# Altium schematic sheet USB_CH340G.SchDoc
size A; DocumentNumber: 5; SheetNumber: 5; SheetTotal: 7
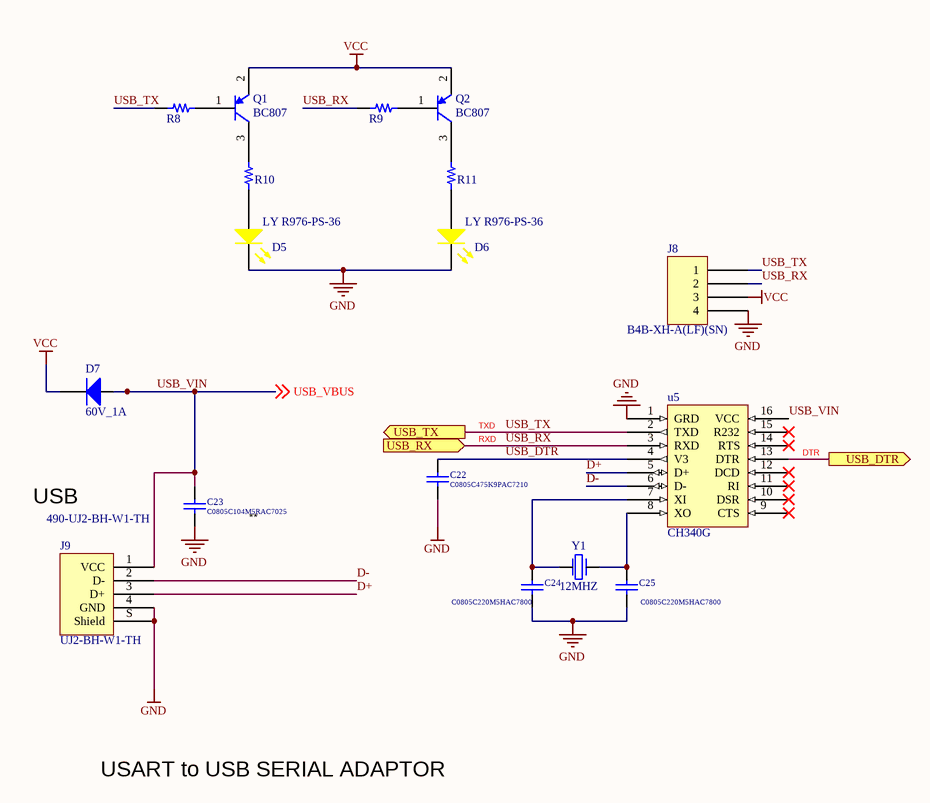
[diagram p0: USB_CH340G.SchDoc]

## Parts
C22  C0805C475K9PAC7210  [CAP SMD 0805]
C23  C0805C104M5RAC7025  [CAP SMD 0805]
C24  C0805C220M5HAC7800  [CAP SMD 0805]
C25  C0805C220M5HAC7800  [CAP SMD 0805]
D5  LY R976-PS-36  [LED 0805]
D6  LY R976-PS-36  [LED 0805]
D7  60V_1A  [SOD-123-]
J8  B4B-XH-A(LF)(SN)  [XH-Conn 1*4 straight]
J9  UJ2-BH-W1-TH  Supplier Part Number 1: 490-UJ2-BH-W1-TH  [FCI USB 61729-1011BLF]
Q1  BC807  [SOT-23]
Q2  BC807  [SOT-23]
R8  1K  [RES SMD 0805]  (value not drawn)
R9  1K  [RES SMD 0805]  (value not drawn)
R10  1K  [RES SMD 0805]  (value not drawn)
R11  1K  [RES SMD 0805]  (value not drawn)
u5  CH340G  [16-SOIC]
Y1  12MHZ  [AP7-00085]

## Ports
USB_DTR (out), USB_RX (in), USB_TX (out)

## Nets
GND: C22.1 C23.1 C24.1 C25.1 D5.1(Cathode) D6.1(Cathode) J8.4 J9.4(GND) J9.S(Shield) u5.1(GRD)
VCC: D7.1(CATHODE) J8.3 Q1.2(E) Q2.2(E)
D+: J9.3(D+) u5.5(D+)
D-: J9.2(D-) u5.6(D-)
DTR: u5.13(DTR) ; port USB_DTR
RXD: J8.2 R9.1 u5.3(RXD) ; port USB_RX  [also labelled USB_RX]
TXD: J8.1 R8.1 u5.2(TXD) ; port USB_TX  [also labelled USB_TX]
USB_DTR: C22.2 u5.4(V3)
USB_VIN: C23.2 D7.2(ANODE) J9.1(VCC) u5.16(VCC) ; off-sheet USB_VBUS  [also labelled USB_VBUS]
NetC24_2: C24.2 u5.7(XI) Y1.1
NetC25_2: C25.2 u5.8(XO) Y1.2
NetD5_2: D5.2(Anode) R10.1
NetD6_2: D6.2(Anode) R11.1
NetQ1_1: Q1.1(B) R8.2
NetQ1_3: Q1.3(C) R10.2
NetQ2_1: Q2.1(B) R9.2
NetQ2_3: Q2.3(C) R11.2

Not connected (* = marked no-connect by the designer): u5 9(CTS)* 10(DSR)* 11(RI)* 12(DCD)* 14(RTS)* 15(R232)*

## Notes on the sheet
- USB
- **
- USART to USB SERIAL ADAPTOR

## Library data of the parts
C22 = Cap_3: 4.7 µF ±10% 6.3V Ceramic Capacitor X5R 0805 (2012 Metric); Value: 0.1uF; Published: 8-Jun-2000; LatestRevisionDate: 17-Jul-2002; LatestRevisionNote: Re-released for DXP Platform.; PackageReference: RAD-0.3; Publisher: Altium Limited; PackageDescription: Radial Cap, Thru-Hole; 2 Leads; 0.3 in Pin Spacing
C23 = Cap_3: 0.1 µF ±20% 50V Ceramic Capacitor X7R 0805 (2012 Metric); Value: 0.1uF; Published: 8-Jun-2000; LatestRevisionDate: 17-Jul-2002; LatestRevisionNote: Re-released for DXP Platform.; PackageReference: RAD-0.3; Publisher: Altium Limited; PackageDescription: Radial Cap, Thru-Hole; 2 Leads; 0.3 in Pin Spacing
C24 C25 = Cap_3: 22 pF ±20% 50V Ceramic Capacitor X8R 0805 (2012 Metric); Value: 0.1uF; Published: 8-Jun-2000; LatestRevisionDate: 17-Jul-2002; LatestRevisionNote: Re-released for DXP Platform.; PackageReference: RAD-0.3; Publisher: Altium Limited; PackageDescription: Radial Cap, Thru-Hole; 2 Leads; 0.3 in Pin Spacing
D5 D6 = SMD LED INDICATORS: LED YELLOW DIFFUSED 0805 SMD
D7 = Diod_1: DIODE SCHOTTKY 60V 1A SOD123; Published: 8-Jun-2000; LatestRevisionDate: 17-Jul-2002; LatestRevisionNote: Re-released for DXP Platform.; PackageVersion: Sep-1996; PackageReference: SMC; Publisher: Altium Limited; PackageDescription: DO-214-AB/SMC; 2 C-Bend Leads; Body 7.9 x 5.9 mm, inc. leads (LxW); Code_JEDEC: DO-214-AB
J8 = B4B-XH-A(LF)(SN): CONN HEADER VERT 4POS 2.5MM; Manufacturer: JST Sales America Inc.; Contact Length - Post: 0.134" (3.40mm); Current Rating (Amps): 3A; Material Flammability Rating: UL94 V-0; Number of Positions: 4; Number of Positions Loaded: All; Pitch - Mating: 0.098" (2.50mm); Shrouding: Shrouded - 4 Wall; Style: Board to Cable/Wire; Voltage Rating: 250V; Part Number: B4B-XH-A(LF)(SN); ComponentLink1Description: Datasheet; ComponentLink1URL: http://www.jst-mfg.com/product/pdf/eng/eXH.pdf; ComponentLink2Description: DigiKey Link; ComponentLink2URL: http://digikey.com/product-detail/en/jst-sales-america-inc/B4B-XH-A-LF-SN/455-2249-ND/1651047; Connector Type: Header; Contact Finish - Mating: Tin; Contact Finish - Post: Tin; Contact Material: Brass; Contact Shape: Square; Contact Type: Male Pin; Fastening Type: Detent Lock; Insulation Color: Natural; Insulation Height: 0.276" (7.00mm); Insulation Material: Polyamide (PA66), Nylon 6/6; LastUpdated: 1/12/2020 11:46:34 PM; Lifecycle Status: Active; Minimum Order: 1; Mounting Type: Through Hole; Number of Rows: 1; Operating Temperature: -25°C ~ 85°C; Packaging: Bulk; PartId: 69; Part Status: Active; Price: 0.21; Series: XH; Supplier 1: DigiKey; Supplier Part Number 1: 455-2249-ND; Termination: Press-Fit, Solder
J9 = USB 2.0 Type B: USB-B (USB TYPE-B) USB 2.0 Receptacle Connector 4 Position Through Hole, Right Angle; Supplier 1: Mouser
Q1 Q2 = PNP Transistor: TRANS PNP 45V 0.5A SOT-23; Published: 8-Jun-2000; LatestRevisionDate: 29-May-2009; LatestRevisionNote: IPC-7351 Footprint Added.; PackageVersion: Aug-1999; PackageReference: SOT-23B; Publisher: Altium Limited; PackageDescription: 3-Pin SOT-23 Package 0.95 mm Pitch, 2.4 mm Lead Span
R8-R11 = RESISTOR: RES SMD 1K OHM 1% 1/4W 0805
u5 = CH340G: CH340G USB TO SERIAL (TTL) IC
Y1 = CRYSTAL: 12 MHz ±30ppm Crystal 20pF 50 Ohms HC-49/US; PartGroup: Frequency devices,Crystals,THM; Manufacturer: TXC Corporation; MPN: 9B08100001-A1; AN: A07-0123; Value: 8.192MHz; ComponentStatus: 'New (not verified)'; Status: Active; Verified by: Sveinung Helgeland; Verified date: 2006-02-17; Height: 3.29999995231628; FootprintStatus: 'New (Not verified)'